# Altium schematic sheet ESQUEMATICOS1.SchDoc (part 1 of 2)
size A3; Date: 6/10/2021; Author: Jonathan Menéndez; Organization: Altium Limited; Address1: L3, 12a Rodborough Rd; Address2: Frenchs Forest; Address3: NSW; Address4: Australia 2086; DocumentNumber: 1; Revision: V1.0; SheetNumber: 1; SheetTotal: 4; Size: Letter
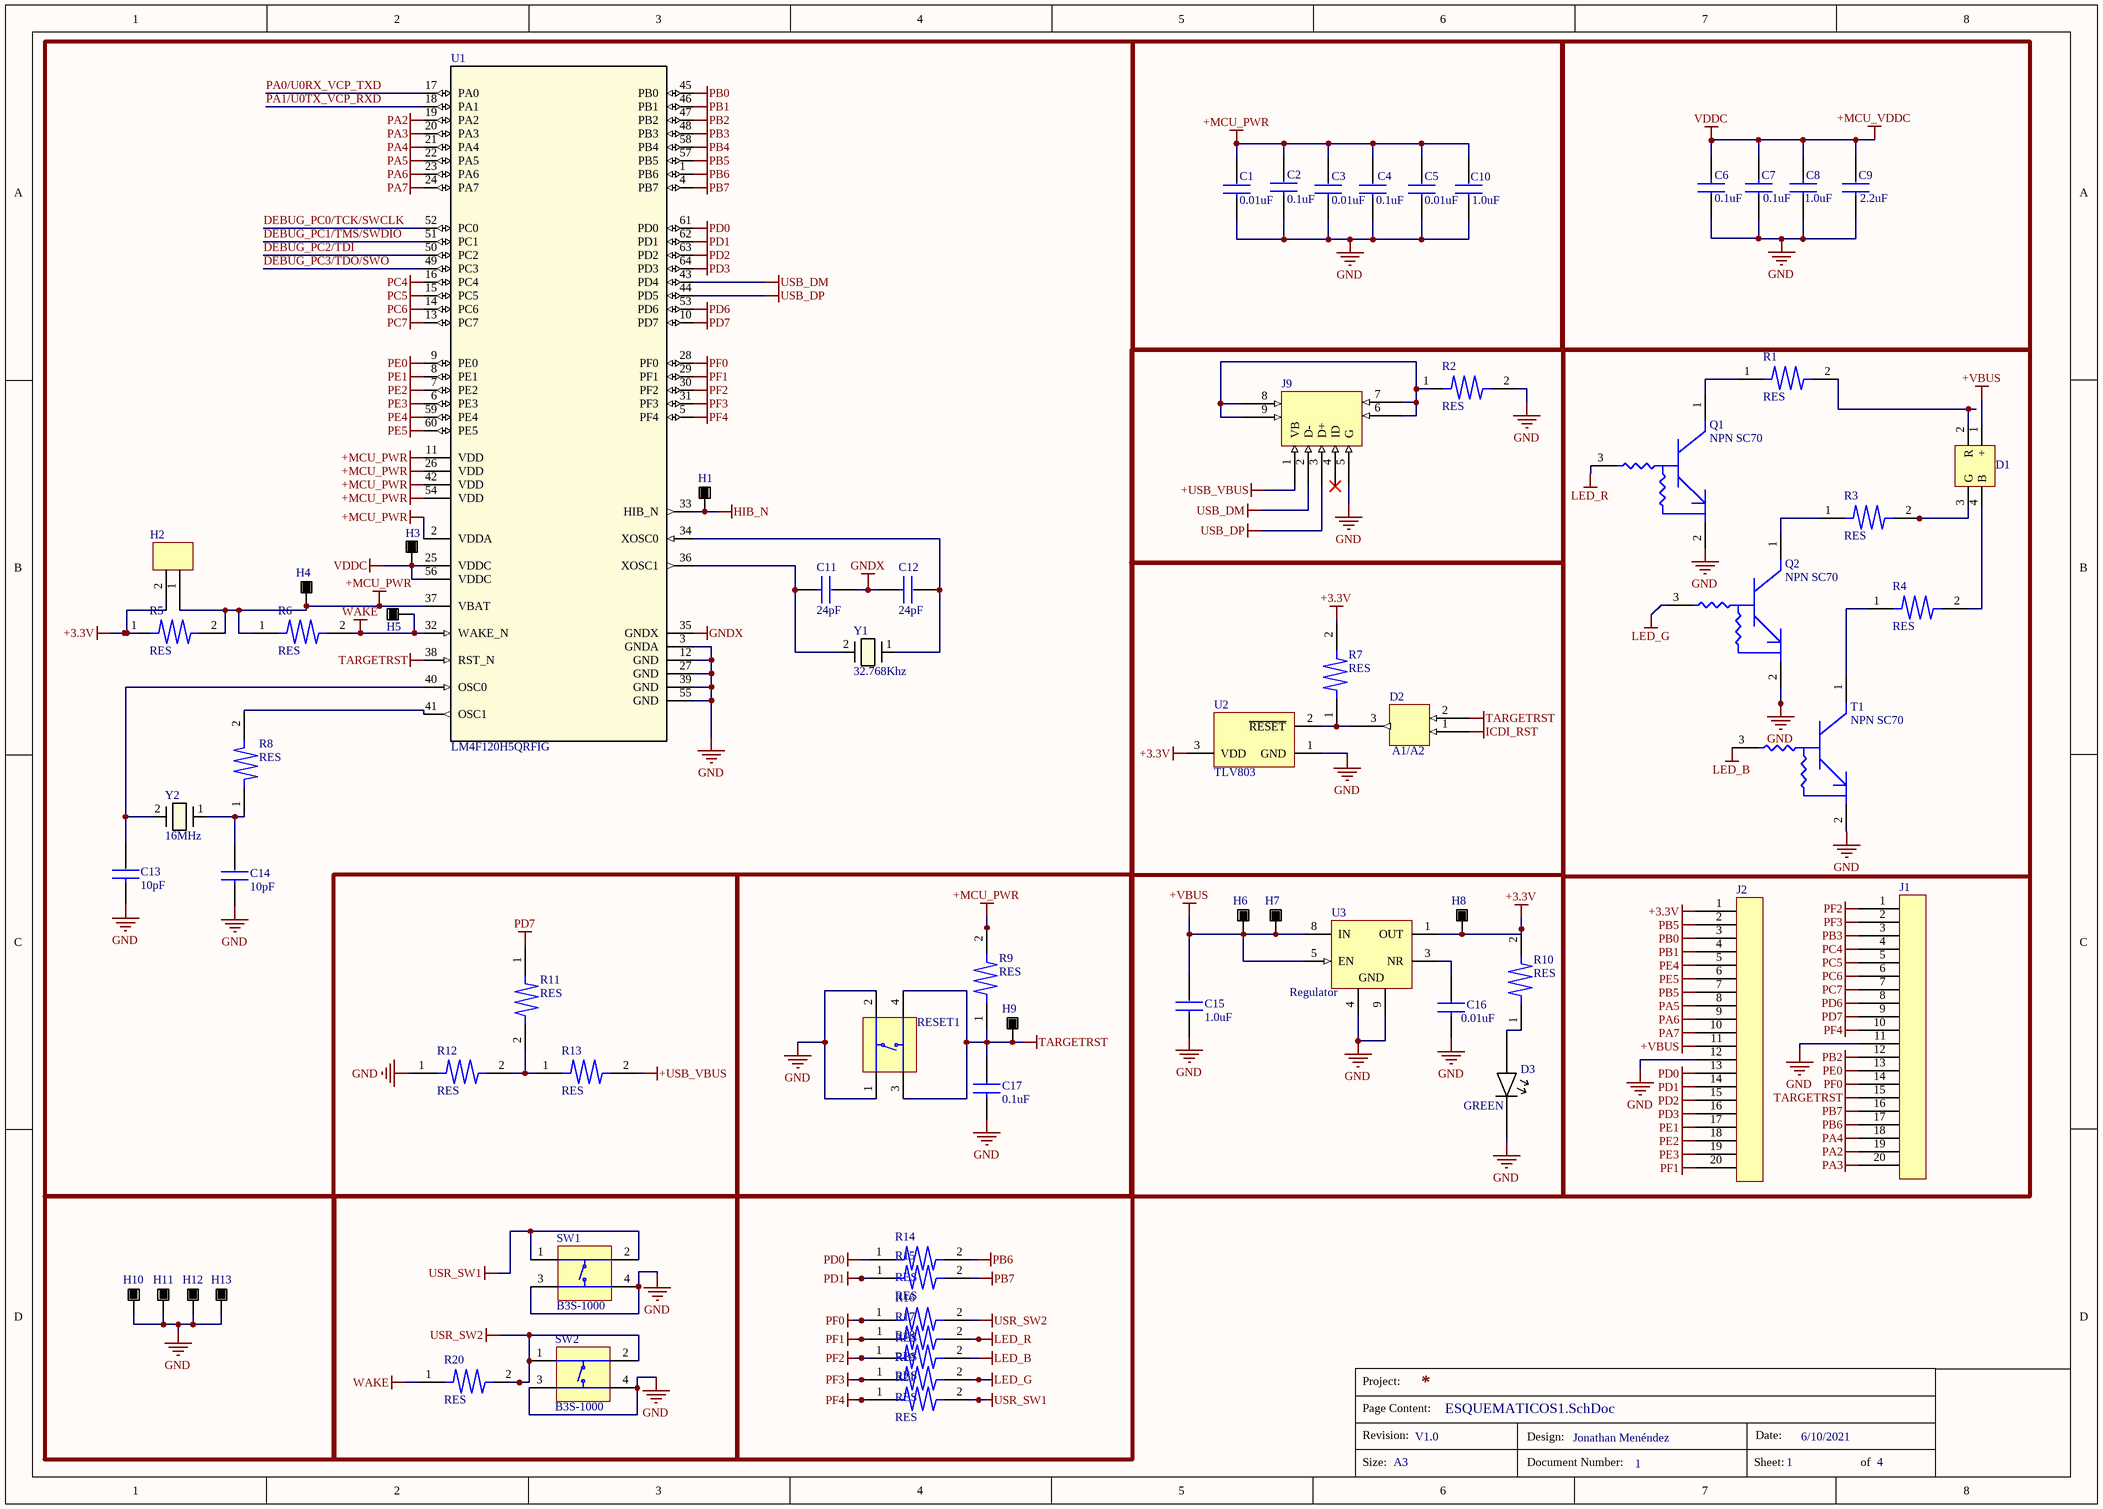
[diagram p0: ESQUEMATICOS1.SchDoc]

## Parts
C1  0.01uF  [CAP 0402]
C2  0.1uF  [CAP 0402]
C3  0.01uF  [CAP 0402]
C4  0.1uF  [CAP 0402]
C5  0.01uF  [CAP 0402]
C6  0.1uF  [CAP 0402]
C7  0.1uF  [CAP 0402]
C8  1.0uF  [CAP 0402]
C9  2.2uF
C10  1.0uF  [CAP 0402]
C11  24pF  [CAP 0402]
C12  24pF  [CAP 0402]
C13  10pF  [CAP 0402]
C14  10pF  [CAP 0402]
C15  1.0uF  [CAP 0402]
C16  0.01uF  [CAP 0402]
C17  0.1uF  [CAP 0402]
D1  18-038/RSGHBHC1-S02/2T  [18-038/RSGHBHC1-S02/2T]  (value not drawn)
D2  A1/A2  [BAS70W-05-7-F]
D3  GREEN  [LTST-C171GKT]
H1  Single Head  [Connector]  (value not drawn)
H2  961102-6404-AR  [HEADER 2 PIN]  (value not drawn)
H3  Single Head  [Connector]  (value not drawn)
H4  Single Head  [Connector]  (value not drawn)
H5  Single Head  [Connector]  (value not drawn)
H6  Single Head  [Connector]  (value not drawn)
H7  Single Head  [Connector]  (value not drawn)
H8  Single Head  [Connector]  (value not drawn)
H9  Single Head  [Connector]  (value not drawn)
H10  Single Head  [Connector]  (value not drawn)
H11  Single Head  [Connector]  (value not drawn)
H12  Single Head  [Connector]  (value not drawn)
H13  Single Head  [Connector]  (value not drawn)
J1  SSW-110-23-S-D  [H2-2X10]  (value not drawn)
J2  SSW-110-23-S-D  [H2-2X10]  (value not drawn)
J9  ZX62-B-5PA(11)  [Micro USB 2.0 Type B]  (value not drawn)
Q1  NPN SC70  [SOT130P220X90-3N]
Q2  NPN SC70  [SOT130P220X90-3N]
R1  RES  [RES 0402]
R2  RES  [RES 0603]
R3  RES  [RES 0402]
R4  RES  [RES 0402]
R5  RES  [RES 0603]
R6  RES  [RES 0402]
R7  RES  [RES 0402]
R8  RES  [RES 0603]
R9  RES  [RES 0402]
R10  RES  [RES 0402]
R11  RES  [RES 0603]
R12  RES  [RES 0402]
R13  RES  [RES 0402]
R14  RES  [RES 0603]
R15  RES  [RES 0603]
R16  RES  [RES 0603]
R17  RES  [RES 0603]
R18  RES  [RES 0603]
R19  RES  [RES 0603]
R20  RES  [RES 0402]
R21  RES  [RES 0603]
RESET1  B3S-1000  [B3S-1000]  (value not drawn)
SW1  B3S-1000  [B3S-1000]
SW2  B3S-1000  [B3S-1000]
T1  NPN SC70  [SOT130P220X90-3N]
U1  LM4F120H5QRFIG  [LM4F120H5QRFIG]
U2  TLV803  [TLV803MDBZR]
U3  Regulator  [TPS73633DRBT]
Y1  32.768Khz  [AB26TRB-32.768KHZ-T]
Y2  16MHz  [ABM3-16.000MHZ-B2-T]

## Nets
+3.3V: H2.2 H8.1 J2.1 R5.1 R7.2 R10.2 U2.3(VDD) U3.1(OUT)
+MCU_PWR: C1.2 C2.2 C3.2 C4.2 C5.2 C10.2 H2.1 H4.1 R5.2 R6.1 R9.2 U1.2(VDDA) U1.11(VDD) U1.26(VDD) U1.37(VBAT) U1.42(VDD) U1.54(VDD)
+MCU_VDDC: C6.1 C7.1 C8.1 C9.2 H3.1 U1.25(VDDC) U1.56(VDDC)  [also labelled VDDC]
+USB_VBUS: J9.1(VB) R13.2
+VBUS: C15.2 D1.1(+) H6.1 H7.1 J2.11 U3.5(EN) U3.8(IN)
GND: C1.1 C2.1 C3.1 C4.1 C5.1 C6.2 C7.2 C8.2 C9.1 C10.1 C13.1 C14.1 C15.1 C16.1 C17.1 D3.2(-) H10.1 H11.1 H12.1 H13.1 J1.11 J2.12 J9.5(G) Q1.2 Q2.2 R2.2 R12.1 RESET1.1 RESET1.2 SW1.3 SW1.4 SW2.3 SW2.4 T1.2 U1.3(GNDA) U1.12(GND) U1.27(GND) U1.39(GND) U1.55(GND) U2.1(GND) U3.4(GND) U3.9(GND)
GNDX: C11.2 C12.1 U1.35(GNDX)
HIB_N: H1.1 U1.33(HIB_N)
ICDI_RST: D2.1
LED_B: R18.2 T1.3
LED_G: Q2.3 R19.2
LED_R: Q1.3 R17.2
PA2: J1.19 U1.19(PA2)
PA3: J1.20 U1.20(PA3)
PA4: J1.18 U1.21(PA4)
PA5: J2.8 U1.22(PA5)
PA6: J2.9 U1.23(PA6)
PA7: J2.10 U1.24(PA7)
PB0: J2.3 U1.45(PB0)
PB1: J2.4 U1.46(PB1)
PB2: J1.12 U1.47(PB2)
PB3: J1.3 U1.48(PB3)
PB4: U1.58(PB4)
PB5: J2.2 J2.7 U1.57(PB5)
PB6: J1.17 R14.2 U1.1(PB6)
PB7: J1.16 R15.2 U1.4(PB7)
PC4: J1.4 U1.16(PC4)
PC5: J1.5 U1.15(PC5)
PC6: J1.6 U1.14(PC6)
PC7: J1.7 U1.13(PC7)
PD0: J2.13 R14.1 U1.61(PD0)
PD1: J2.14 R15.1 U1.62(PD1)
PD2: J2.15 U1.63(PD2)
PD3: J2.16 U1.64(PD3)
PD6: J1.8 U1.53(PD6)
PD7: J1.9 R11.1 U1.10(PD7)
PE0: J1.13 U1.9(PE0)
PE1: J2.17 U1.8(PE1)
PE2: J2.18 U1.7(PE2)
PE3: J2.19 U1.6(PE3)
PE4: J2.5 U1.59(PE4)
PE5: J2.6 U1.60(PE5)
PF0: J1.14 R16.1 U1.28(PF0)
PF1: J2.20 R17.1 U1.29(PF1)
PF2: J1.1 R18.1 U1.30(PF2)
PF3: J1.2 R19.1 U1.31(PF3)
PF4: J1.10 R21.1 U1.5(PF4)
TARGETRST: C17.2 D2.2 H9.1 J1.15 R9.1 RESET1.3 RESET1.4 U1.38(RST_N)
USB_DM: J9.2(D-) U1.43(PD4)
USB_DP: J9.3(D+) U1.44(PD5)
USR_SW1: R21.2 SW1.1 SW1.2
USR_SW2: R16.2 R20.2 SW2.1 SW2.2
WAKE: H5.1 R6.2 R20.1 U1.32(WAKE_N)
DEBUG_PC0/TCK/SWCLK: U1.52(PC0)
DEBUG_PC1/TMS/SWDIO: U1.51(PC1)
DEBUG_PC2/TDI: U1.50(PC2)
DEBUG_PC3/TDO/SWO: U1.49(PC3)
PA0/U0RX_VCP_TXD: U1.17(PA0)
PA1/U0TX_VCP_RXD: U1.18(PA1)
NetC11_1: C11.1 U1.36(XOSC1) Y1.2
NetC12_2: C12.2 U1.34(XOSC0) Y1.1
NetC13_2: C13.2 U1.40(OSC0) Y2.2
NetC14_2: C14.2 R8.1 Y2.1
NetC16_2: C16.2 U3.3(NR)
NetD1_2: D1.2(R) R1.2
NetD1_3: D1.3(G) R3.2
NetD1_4: D1.4(B) R4.2
NetD2_3: D2.3 R7.1 U2.2(~{RESET})
NetD3_1: D3.1(+) R10.1
NetJ9_6: J9.6 J9.7 J9.8 J9.9 R2.1
NetQ1_1: Q1.1 R1.1
NetQ2_1: Q2.1 R3.1
NetR4_1: R4.1 T1.1
NetR8_2: R8.2 U1.41(OSC1)
NetR11_2: R11.2 R12.2 R13.1

Not connected (* = marked no-connect by the designer): J9 4(ID)*

## Notes on the sheet
- Project:
- Page Content:
- Revision:
- Design:
- Date:
- Size:
- A3
- Document Number:
- Sheet:
- of